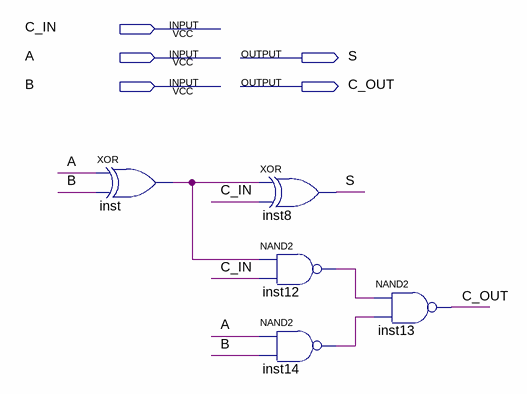
[diagram p0: schematic sheet]
// Quartus schematic FA.bdf as structural Verilog: 5 symbols, 5 pins
module FA (
  input  C_IN,
  input  A,
  input  B,
  output S,
  output C_OUT
);

  wire inst12_out, inst14_out, inst_out;

  xor inst (inst_out, A, B);
  xor inst8 (S, inst_out, C_IN);
  nand inst12 (inst12_out, inst_out, C_IN);
  nand inst14 (inst14_out, A, B);
  nand inst13 (C_OUT, inst12_out, inst14_out);
endmodule
